# Altium project RT5572_2.4TX.PrjPcb
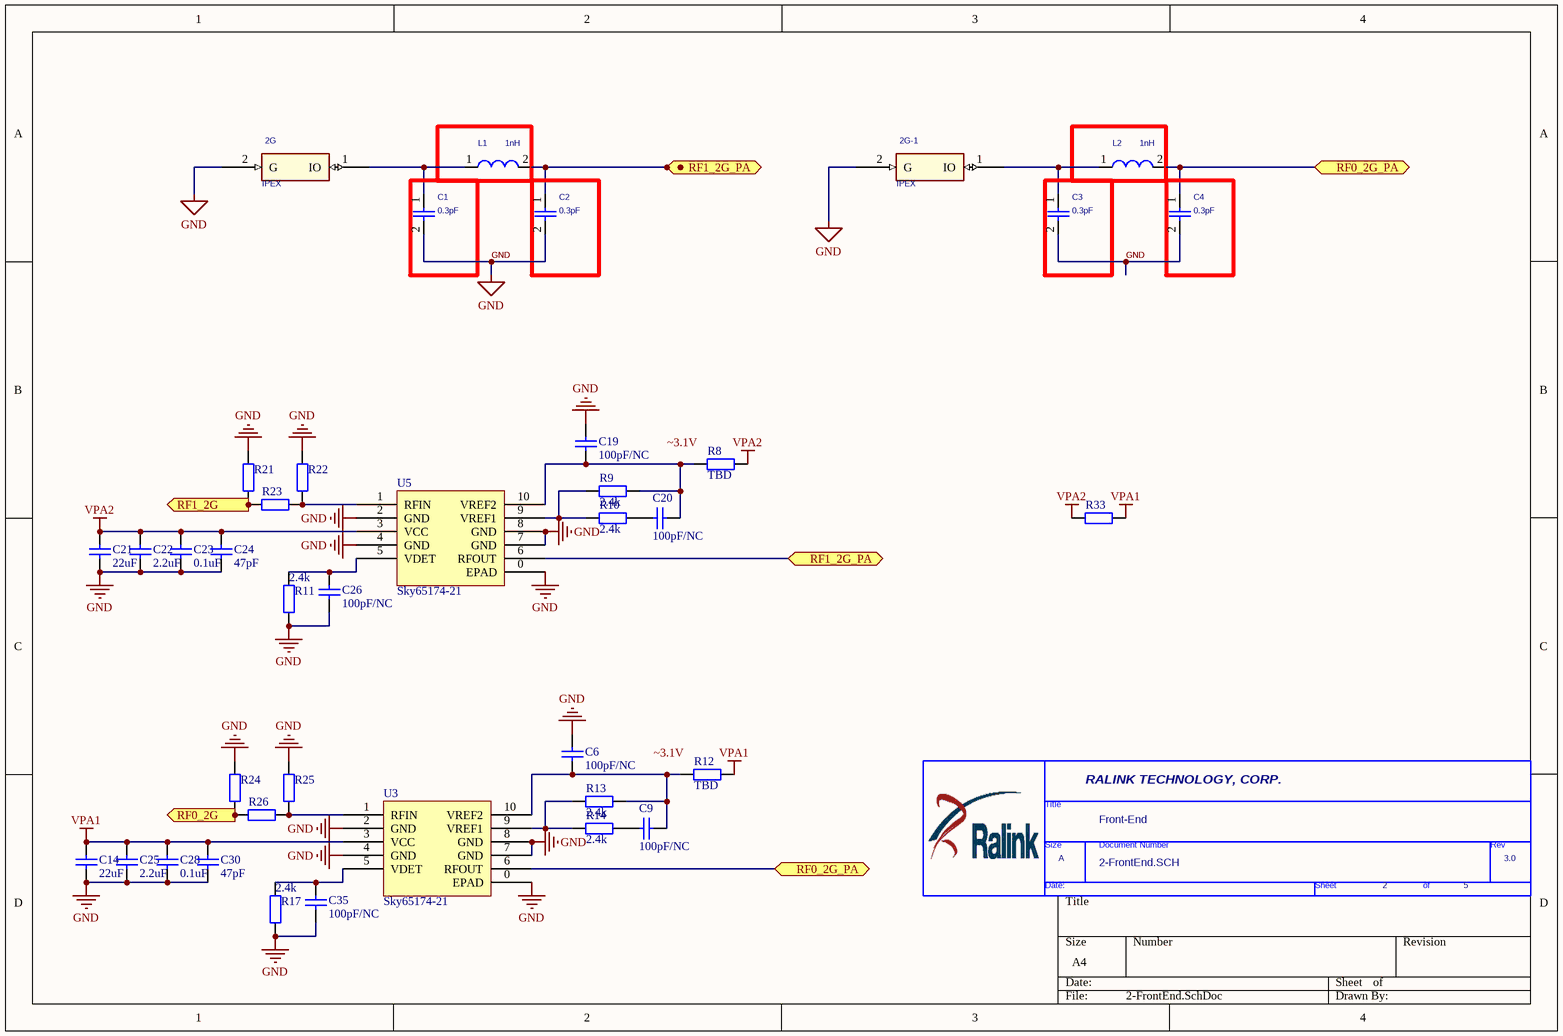
[diagram p0: 2-FrontEnd.SchDoc]
4 sheets, 123 parts. Net scope: flat (ports and power ports of the same name join across sheets).
Board file: RT5572.PcbDoc
Sheets:
  2-FrontEnd.SchDoc
  3-RT5572-WLAN.SchDoc
  4-USB-A.SchDoc
  5-BLOCK-2X2-DUAL.SchDoc

## Sheet 2-FrontEnd.SchDoc
size A4

### Parts
(Parts that share a designator on the sheet are numbered #1, #2 ... from top to bottom, then left to right.)
2G  IPEX  [IPEX]
2G-1  IPEX  [IPEX]
*#1  Page Count: 5  Page Number: 2  Page Size: A  OrgName: RALINK TECHNOLOGY, CORP.  Title: Front-End  RevCode: 3.0  Doc: 2-FrontEnd.SCH  (hidden comment: TitleBlock1-RA-new)  (graphical)
C1  0.3pF  [0402]
C2  0.3pF  [0402]
C3  0.3pF  [0402]
C4  0.3pF  [0402]
C6  value 100pF/NC  [0402]  (hidden comment: Cap)
C9  value 100pF/NC  [0402]  (hidden comment: Cap)
C14  value 22uF  [0805]  (hidden comment: Cap)
C19  value 100pF/NC  [0402]  (hidden comment: Cap)
C20  value 100pF/NC  [0402]  (hidden comment: Cap)
C21  value 22uF  [0805]  (hidden comment: Cap)
C22  value 2.2uF  [0603]  (hidden comment: Cap)
C23  value 0.1uF  [0402]  (hidden comment: Cap)
C24  value 47pF  [0402]  (hidden comment: Cap)
C25  value 2.2uF  [0603]  (hidden comment: Cap)
C26  value 100pF/NC  [0402]  (hidden comment: Cap)
C28  value 0.1uF  [0402]  (hidden comment: Cap)
C30  value 47pF  [0402]  (hidden comment: Cap)
C35  value 100pF/NC  [0402]  (hidden comment: Cap)
L1  1nH  [0402]
L2  1nH  [0402]
R8  value TBD  [0402]  (hidden comment: Res2)
R9  value 2.4k  [0402]  (hidden comment: Res2)
R10  value 2.4k  [0402]  (hidden comment: Res2)
R11  value 2.4k  [0402]  (hidden comment: Res2)
R12  value TBD  [0402]  (hidden comment: Res2)
R13  value 2.4k  [0402]  (hidden comment: Res2)
R14  value 2.4k  [0402]  (hidden comment: Res2)
R17  value 2.4k  [0402]  (hidden comment: Res2)
R21  TBD  [0402]  (value not drawn)
R22  TBD  [0402]  (value not drawn)
R23  TBD  [0402]  (value not drawn)
R24  TBD  [0402]  (value not drawn)
R25  TBD  [0402]  (value not drawn)
R26  TBD  [0402]  (value not drawn)
R33  NC/0R  [0402]  (value not drawn)
U3  Sky65174-21  [SKY65174-21]
U5  Sky65174-21  [SKY65174-21]

### Ports
RF0_2G (in), RF0_2G_PA, RF1_2G (in), RF1_2G_PA

### Nets
GND: 2G.2(G) 2G-1.2(G) C1.2 C2.2 C3.2 C4.2 C6.1 C14.2 C19.1 C21.2 C22.2 C23.2 C24.2 C25.2 C26.2 C28.2 C30.2 C35.2 R11.1 R17.1 R21.2 R22.1 R24.1 R25.1 U3.0(EPAD) U3.2(GND) U3.4(GND) U3.7(GND) U3.8(GND) U5.0(EPAD) U5.2(GND) U5.4(GND) U5.7(GND) U5.8(GND)
VPA1: C14.1 C25.1 C28.1 C30.1 R12.1 R33.2 U3.3(VCC)
VPA2: C21.1 C22.1 C23.1 C24.1 R8.1 R33.1 U5.3(VCC)
RF0_2G: R24.2 R26.1 ; port RF0_2G
RF1_2G: R21.1 R23.1 ; port RF1_2G
Net2G-1_1: 2G-1.1(IO) C3.1 L2.1
Net2G_1: 2G.1(IO) C1.1 L1.1
NetC2_1: C2.1 L1.2 U5.6(RFOUT) ; port RF1_2G_PA
NetC4_1: C4.1 L2.2 U3.6(RFOUT) ; port RF0_2G_PA
NetC6_2: C6.2 C9.2 R12.2 R13.1 U3.10(VREF2)
NetC9_1: C9.1 R14.1
NetC19_2: C19.2 C20.2 R8.2 R9.1 U5.10(VREF2)
NetC20_1: C20.1 R10.1
NetC26_1: C26.1 R11.2 U5.5(VDET)
NetC35_1: C35.1 R17.2 U3.5(VDET)
NetR9_2: R9.2 R10.2 U5.9(VREF1)
NetR13_2: R13.2 R14.2 U3.9(VREF1)
NetR22_2: R22.2 R23.2 U5.1(RFIN)
NetR25_2: R25.2 R26.2 U3.1(RFIN)

### Notes on the sheet
- Labels drawn without touching a wire or pin: ~3.1V
- (in symbol TitleBlock1-RA-new) Title; Size; Document Number; Rev; Date:; Sheet; of

### Library data of the parts
2G 2G-1 = ANT-RA-USB-1
C1-C4 = CAP/0402
C6 C9 C14 C19-C26 C28 C30 C35 = Cap: Capacitor; Published: 8-Jun-2000; LatestRevisionDate: 17-Jul-2002; LatestRevisionNote: Re-released for DXP Platform.; PackageReference: RAD-0.3; Publisher: Altium Limited; PackageDescription: Radial Cap, Thru-Hole; 2 Leads; 0.3 in Pin Spacing
L1 L2 = L/0402
R8-R14 R17 R21-R26 R33 = Res2: Resistor; Published: 8-Jun-2000; LatestRevisionDate: 17-Jul-2002; LatestRevisionNote: Re-released for DXP Platform.; PackageReference: AXIAL-0.4; Publisher: Altium Limited; PackageDescription: Axial Device, Thru-Hole; 2 Leads; 0.4 in Pin Spacing
*#1 = TitleBlock1-RA-new: Page Create Date: March  8, 1995

## Sheet 3-RT5572-WLAN.SchDoc
size A2
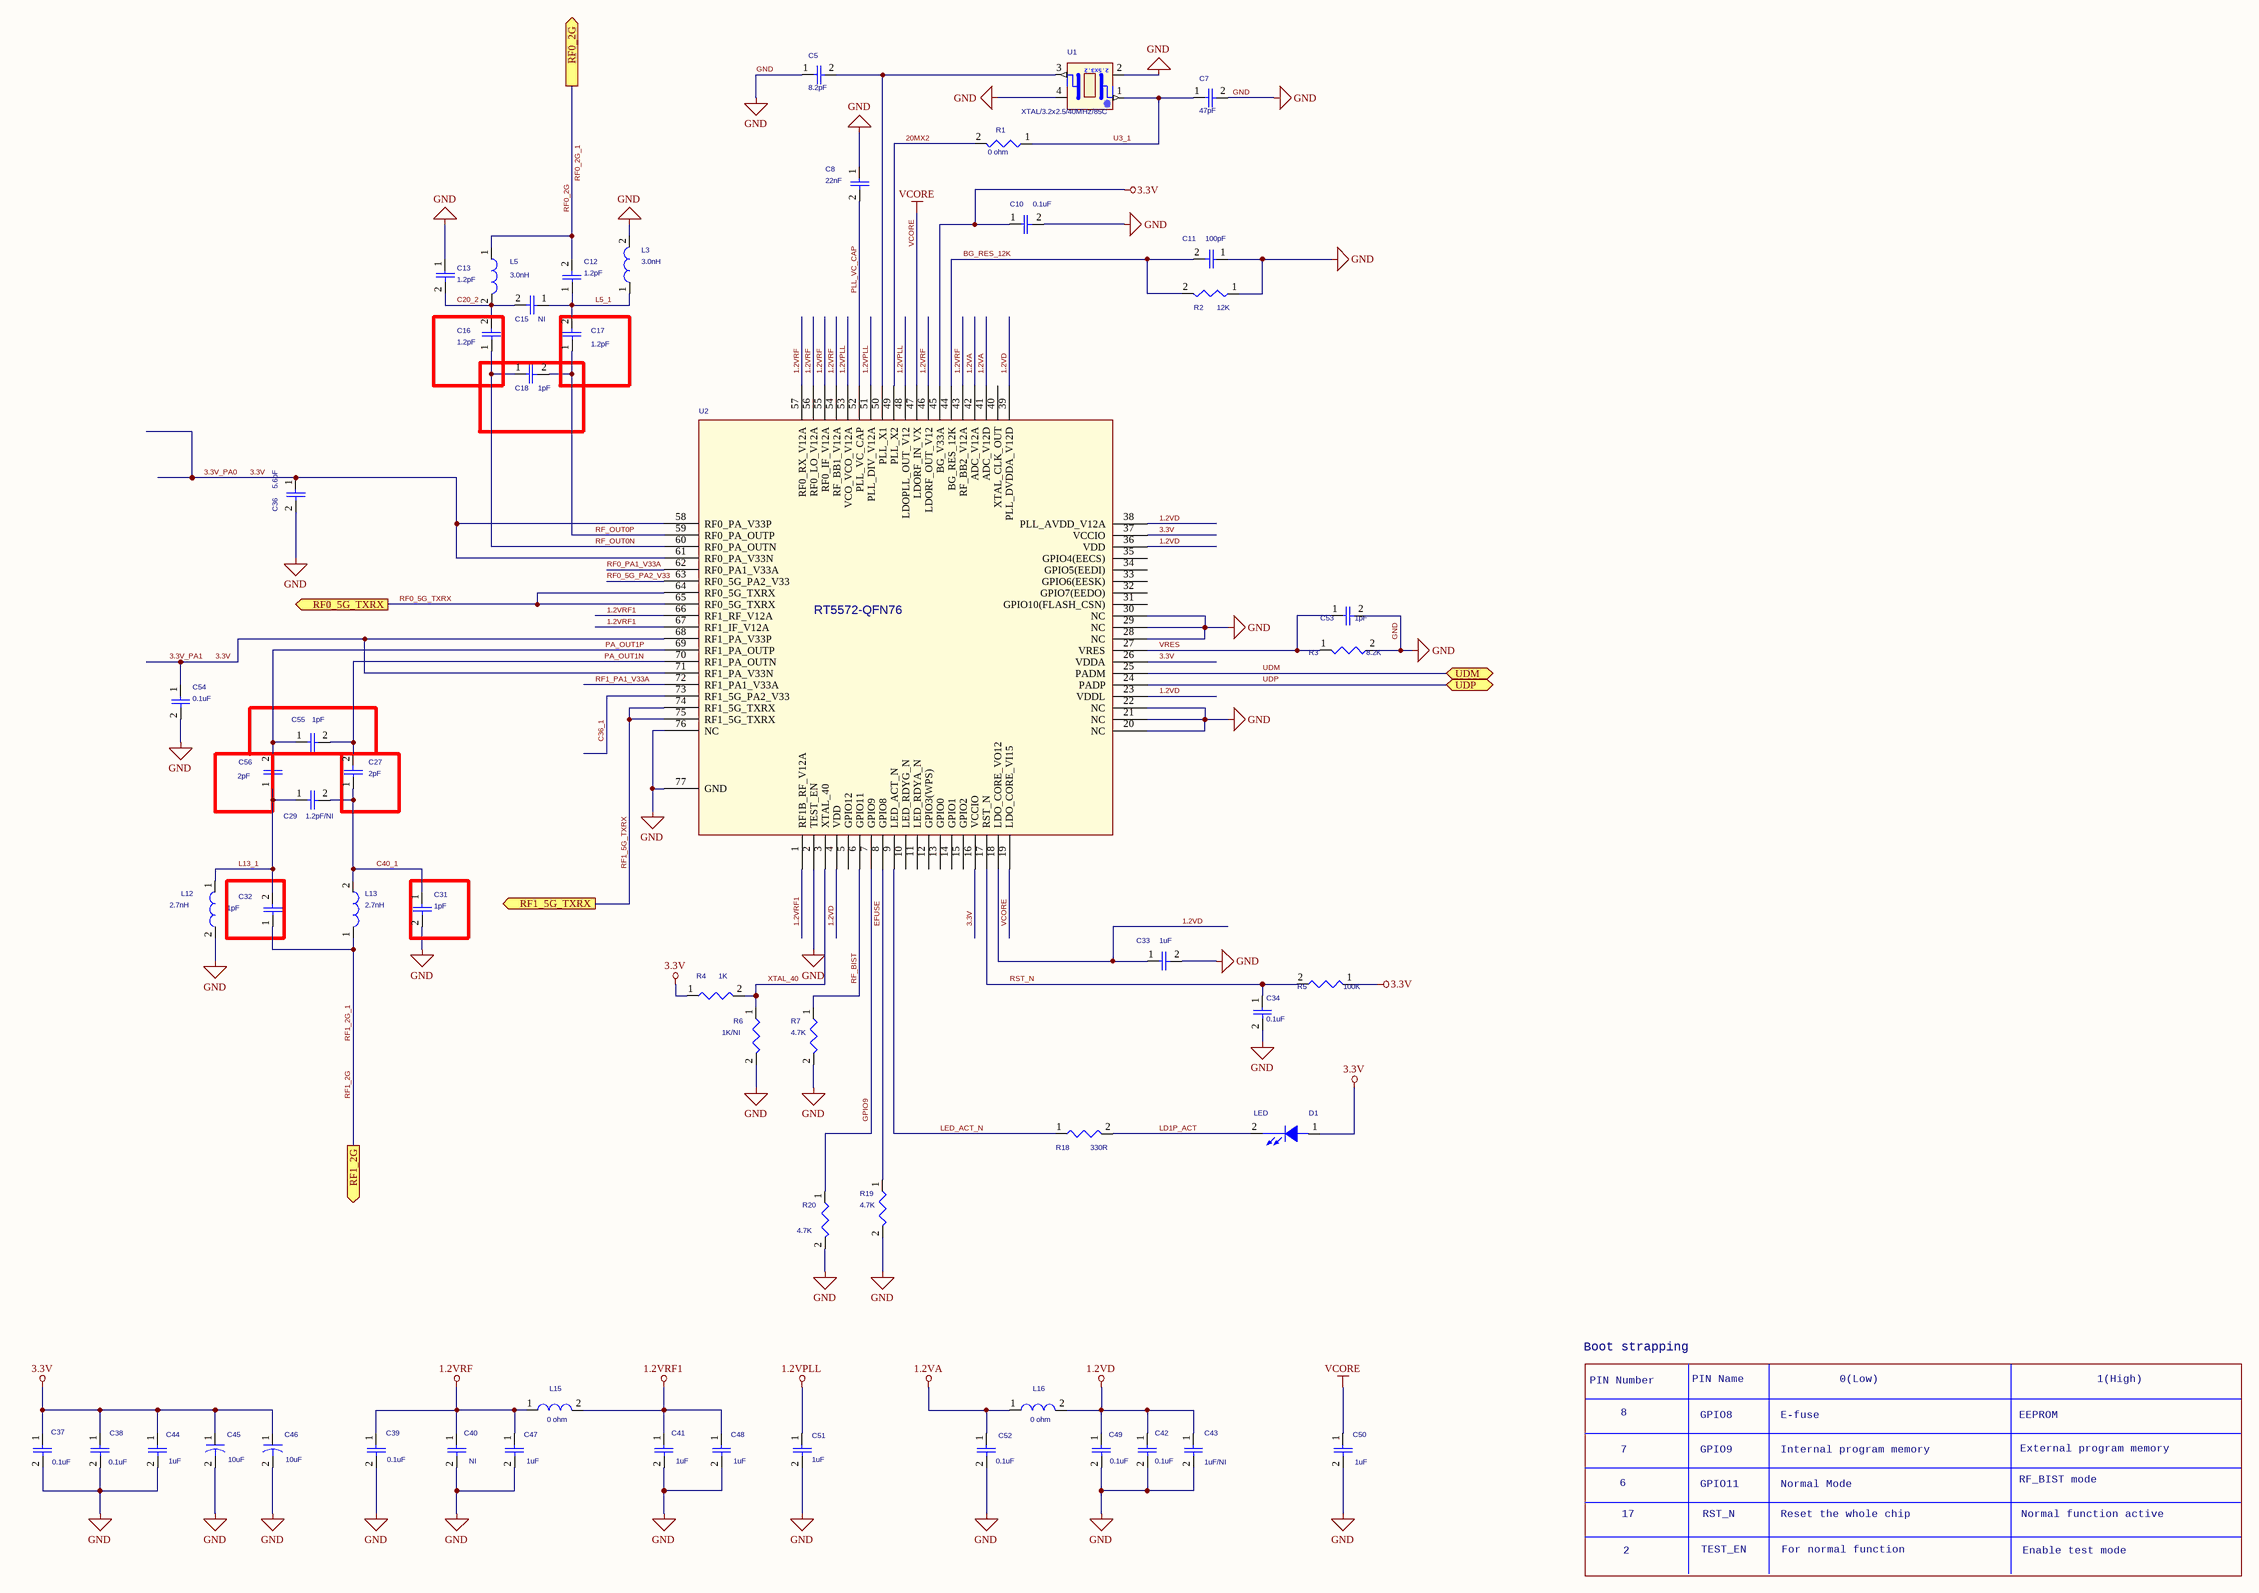
[diagram p1: 3-RT5572-WLAN.SchDoc]

### Parts
C5  8.2pF  [0402]
C7  47pF  [0402]
C8  22nF  [0402]
C10  0.1uF  [0402]
C11  100pF  [0402]
C12  1.2pF  [0402]
C13  1.2pF  [0402]
C15  NI  [0402]
C16  1.2pF  [0402]
C17  1.2pF  [0402]
C18  1pF  [0402]
C27  2pF  [0402]
C29  1.2pF/NI  [0402]
C31  1pF  [0402]
C32  1pF  [0402]
C33  1uF  [0402]
C34  0.1uF  [0402]
C36  5.6pF  [0402]
C37  0.1uF  [0402]
C38  0.1uF  [0402]
C39  0.1uF  [0402]
C40  NI  [0402]
C41  1uF  [0402]
C42  0.1uF  [0402]
C43  1uF/NI  [0402]
C44  1uF  [0402]
C45  10uF  [0805]
C46  10uF  [0805]
C47  1uF  [0402]
C48  1uF  [0402]
C49  0.1uF  [0402]
C50  1uF  [0402]
C51  1uF  [0402]
C52  0.1uF  [0402]
C53  1pF  [0402]
C54  0.1uF  [0402]
C55  1pF  [0402]
C56  2pF  [0402]
D1  LED  [0603]
L3  3.0nH  [0402]
L5  3.0nH  [0402]
L12  2.7nH  [0402]
L13  2.7nH  [0402]
L15  0 ohm  [0402]
L16  0 ohm  [0402]
R1  0 ohm  [0402]
R2  12K  [0402]
R3  8.2K  [0402]
R4  1K  [0402]
R5  100K  [0402]
R6  1K/NI  [0402]
R7  4.7K  [0402]
R18  330R  [0402]
R19  4.7K  [0402]
R20  4.7K  [0402]
U1  XTAL/3.2x2.5/40MHz/85C  [XTAL-SMD/3.2X2.5]
U2  RT5572-QFN76  [QFN40P-900X900X90-77N]

### Ports
RF0_2G (out), RF0_5G_TXRX (out), RF1_2G (out), RF1_5G_TXRX (out), UDM (bidir), UDP (bidir)

### Nets
1.2VA: C52.1 L16.1 U2.41(ADC_V12D) U2.42(ADC_V12A)
1.2VD: C33.1 C42.1 C43.1 C49.1 L16.2 U2.4(VDD) U2.18(LDO_CORE_VO12) U2.23(VDDL) U2.36(VDD) U2.38(PLL_AVDD_V12A) U2.39(PLL_DVDDA_V12D)
1.2VPLL: C51.1 U2.48(LDOPLL_OUT_V12) U2.51(PLL_DIV_V12A) U2.53(VCO_VCO_V12A)
1.2VRF: C39.1 C40.1 C47.1 L15.1 U2.43(RF_BB2_V12A) U2.46(LDORF_OUT_V12) U2.54(RF_BB1_V12A) U2.55(RF0_IF_V12A) U2.56(RF0_LO_V12A) U2.57(RF0_RX_V12A)
1.2VRF1: C41.1 C48.1 L15.2 U2.1(RF1B_RF_V12A) U2.66(RF1_RF_V12A) U2.67(RF1_IF_V12A)
3.3V: C10.1 C36.1 C37.1 C38.1 C44.1 C45.1 C46.1 C54.1 D1.1(ANODE) R4.1 R5.1 U2.16(VCCIO) U2.26(VDDA) U2.37(VCCIO) U2.45(BG_V33A) U2.58(RF0_PA_V33P) U2.61(RF0_PA_V33N) U2.68(RF1_PA_V33P) U2.71(RF1_PA_V33N)  [also labelled 3.3V_PA0, 3.3V_PA1]
GND: C5.1 C7.2 C8.1 C10.2 C11.1 C13.1 C31.2 C33.2 C34.2 C36.2 C37.2 C38.2 C39.2 C40.2 C41.2 C42.2 C43.2 C44.2 C45.2 C46.2 C47.2 C48.2 C49.2 C50.2 C51.2 C52.2 C53.2 C54.2 L3.2 L12.2 R2.1 R3.2 R6.2 R7.2 R19.2 R20.2 U1.2(NC) U1.4(NC) U2.2(TEST_EN) U2.20(NC) U2.21(NC) U2.22(NC) U2.28(NC) U2.29(NC) U2.30(NC) U2.76(NC) U2.77(GND)
VCORE: C50.1 U2.19(LDO_CORE_VI15) U2.47(LDORF_IN_VX)
20MX2: R1.2 U2.49(PLL_X2)
BG_RES_12K: C11.2 R2.2 U2.44(BG_RES_12K)
C20_2: C13.2 C15.2 C16.2 L5.2
C36_1: U2.73(RF1_5G_PA2_V33)
C40_1: C27.1 C29.2 C31.1 L13.2
EFUSE: R19.1 U2.8(GPIO8)
GPIO9: R20.1 U2.7(GPIO9)
L5_1: C12.1 C15.1 C17.2 L3.1
L13_1: C29.1 C32.2 C56.1 L12.1
LD1P_ACT: D1.2(CATHODE) R18.2
LED_ACT_N: R18.1 U2.9(LED_ACT_N)
PA_OUT1N: C27.2 C55.2 U2.70(RF1_PA_OUTN)
PA_OUT1P: C55.1 C56.2 U2.69(RF1_PA_OUTP)
PLL_VC_CAP: C8.2 U2.52(PLL_VC_CAP)
RF0_2G: C12.2 L5.1 ; port RF0_2G  [also labelled RF0_2G_1]
RF0_5G_PA2_V33: U2.63(RF0_5G_PA2_V33)
RF0_5G_TXRX: U2.64(RF0_5G_TXRX) U2.65(RF0_5G_TXRX) ; port RF0_5G_TXRX
RF0_PA1_V33A: U2.62(RF0_PA1_V33A)
RF1_2G: C32.1 L13.1 ; port RF1_2G  [also labelled RF1_2G_1]
RF1_5G_TXRX: U2.74(RF1_5G_TXRX) U2.75(RF1_5G_TXRX) ; port RF1_5G_TXRX
RF1_PA1_V33A: U2.72(RF1_PA1_V33A)
RF_BIST: R7.1 U2.6(GPIO11)
RF_OUT0N: C16.1 C18.1 U2.60(RF0_PA_OUTN)
RF_OUT0P: C17.1 C18.2 U2.59(RF0_PA_OUTP)
RST_N: C34.1 R5.2 U2.17(RST_N)
U3_1: C7.1 R1.1 U1.1(X1)
UDM: U2.25(PADM) ; port UDM
UDP: U2.24(PADP) ; port UDP
VRES: C53.1 R3.1 U2.27(VRES)
XTAL_40: R4.2 R6.1 U2.3(XTAL_40)
NetC5_2: C5.2 U1.3(X2) U2.50(PLL_X1)

Not connected (* = marked no-connect by the designer): U2 5(GPIO12) 10(LED_RDYG_N) 11(LED_RDYA_N) 12(GPIO3(WPS)) 13(GPIO0) 14(GPIO1) 15(GPIO2) 31(GPIO10(FLASH_CSN)) 32(GPIO7(EEDO)) 33(GPIO6(EESK)) 34(GPIO5(EEDI)) 35(GPIO4(EECS)) 40(XTAL_CLK_OUT)

### Notes on the sheet
- Boot strapping
- PIN Number
- PIN Name
- 0(Low)
- 1(High)
- 8
- 7
- GPIO8
- GPIO9
- E-fuse
- Internal program memory
- EEPROM
- External program memory
- 6
- GPIO11
- Normal Mode
- RF_BIST mode
- 17
- 2
- TEST_EN
- RST_N
- Reset the whole chip
- For normal function
- Normal function active
- Enable test mode
- (in symbol XTAL_2.5) 2.5x3.2

### Library data of the parts
C5 C7 C8 C10-C13 C15-C18 C27 C29 C31-C34 C36-C44 C47-C56 = CAP/0402
  C8 C10 C11 C33 C34 C36-C44 C47-C54: 1st Part Field: 0402
C45 C46 = CAP/0603
D1 = LED/0603
L3 L5 L13 L15 L16 = L/0402
L12 = L/0402_0
R1 R2 R5 = RES/0402_1_Dup1
R3 = RES/0402_2
R4 R6 R7 R19 R20 = RES/0402_1_Dup2
R18 = RES/0402_1
U1 = XTAL_2.5
U2 = RT5572_5

## Sheet 4-USB-A.SchDoc
size A4
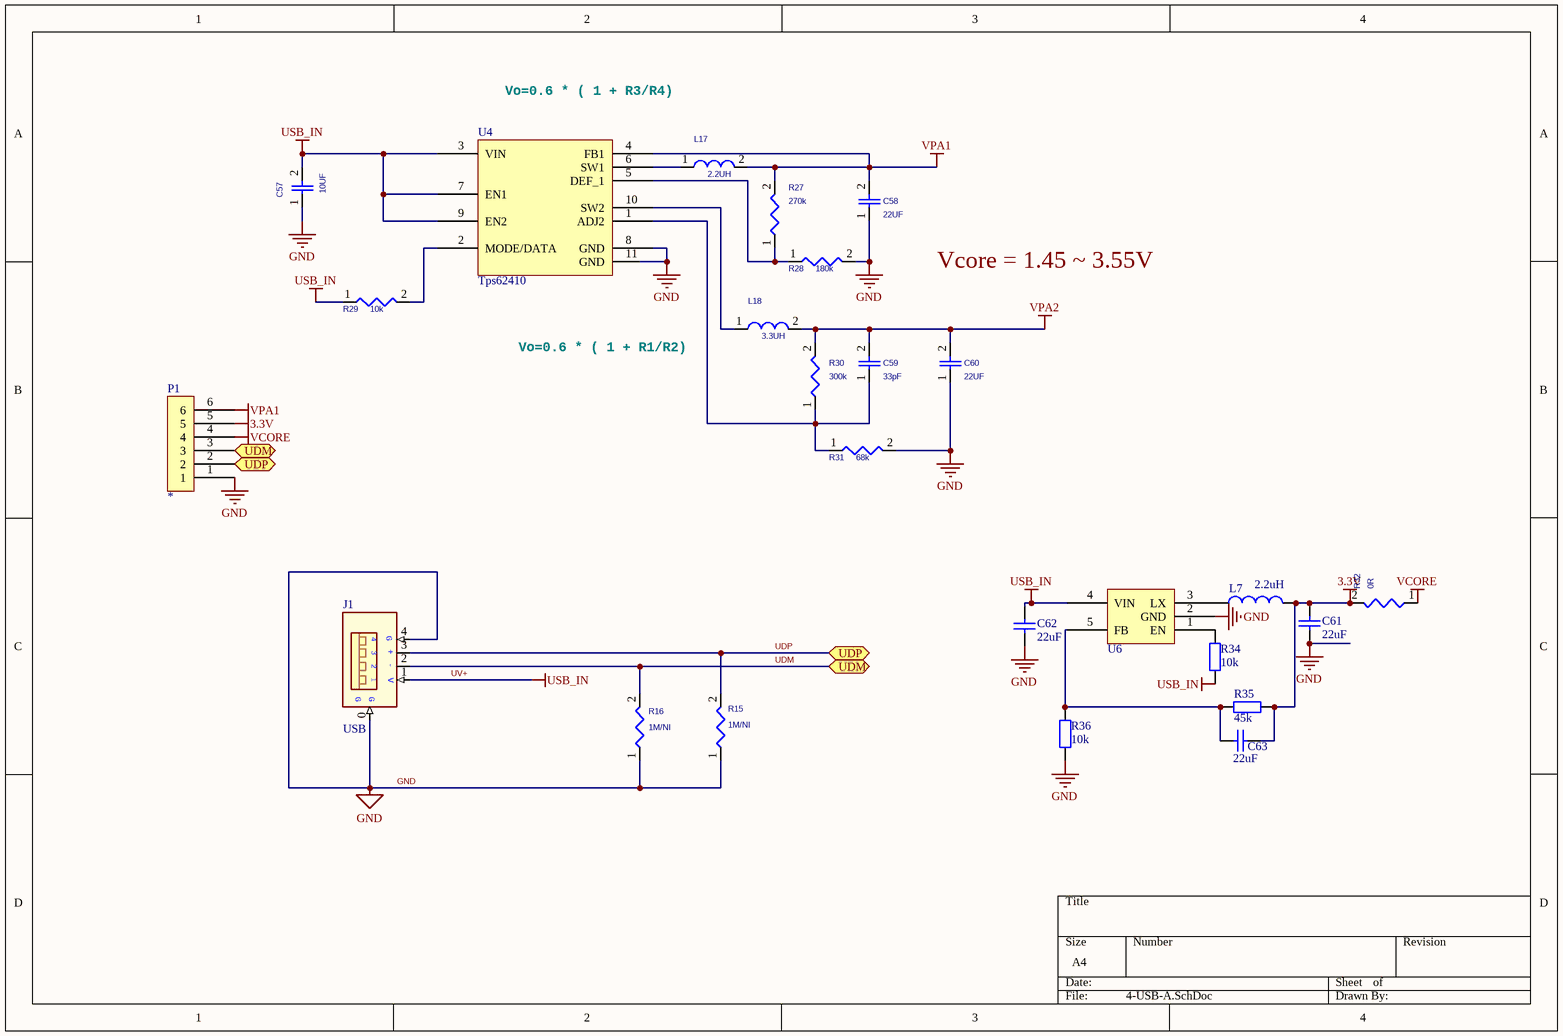
[diagram p2: 4-USB-A.SchDoc]

### Parts
C57  10UF  [0805]
C58  22UF  [0805]
C59  33pF  [0402]
C60  22UF  [0805]
C61  value 22uF  [0805]  (hidden comment: Cap)
C62  value 22uF  [0805]  (hidden comment: Cap)
C63  value 22uF  [0402]  (hidden comment: Cap)
J1  USB  [USB-A-MALE]
L7  2.2uH  [0805]
L17  2.2UH  [L3015]
L18  3.3UH  [L3015]
P1  *  [6PSocket]
R15  1M/NI  [0402]
R16  1M/NI  [0402]
R27  270k  [0402]
R28  180k  [0402]
R29  10k  [0402]
R30  300k  [0402]
R31  68k  [0402]
R32  0R  [0402]
R34  10k  [0402]
R35  45k  [0402]
R36  10k  [0402]
U4  Tps62410  [DFN-10P-3X3]
U6  RT8059  [SOT23-5]  (value not drawn)

### Ports
UDM (bidir), UDP (bidir)

### Nets
3.3V: C61.2 C63.1 L7.2 P1.5 R32.2 R35.2
GND: C57.1 C58.1 C60.1 C61.1 C62.1 J1.0(G) J1.4(G) P1.1 R15.1 R16.1 R28.2 R31.2 R36.1 U4.8(GND) U4.11(GND) U6.2(GND)
UV+: C57.2 C62.2 J1.1(V+) R29.1 R34.2 U4.3(VIN) U4.7(EN1) U4.9(EN2) U6.4(VIN)  [also labelled USB_IN]
VCORE: P1.4 R32.1
VPA1: C58.2 L17.2 P1.6 R27.2 U4.4(FB1)
VPA2: C59.2 C60.2 L18.2 R30.2
UDM: J1.2(D-) P1.3 R16.2 ; port UDM
UDP: J1.3(D+) P1.2 R15.2 ; port UDP
NetC59_1: C59.1 R30.1 R31.1 U4.1(ADJ2)
NetC63_2: C63.2 R35.1 R36.2 U6.5(FB)
NetL7_1: L7.1 U6.3(LX)
NetL17_1: L17.1 U4.6(SW1)
NetL18_1: L18.1 U4.10(SW2)
NetR27_1: R27.1 R28.1 U4.5(DEF_1)
NetR29_2: R29.2 U4.2(MODE/DATA)
NetR34_1: R34.1 U6.1(EN)

### Notes on the sheet
- Vo=0.6 * ( 1 + R3/R4)
- Vcore = 1.45 ~ 3.55V
- Vo=0.6 * ( 1 + R1/R2)
- (in symbol USB) +; -; V

### Library data of the parts
C57 C58 C60 = CAP/0402: 1st Part Field: 0402
C59 = CAP/0402: 1st Part Field: 0402
C61-C63 = Cap: Capacitor; Published: 8-Jun-2000; LatestRevisionDate: 17-Jul-2002; LatestRevisionNote: Re-released for DXP Platform.; PackageReference: RAD-0.3; Publisher: Altium Limited; PackageDescription: Radial Cap, Thru-Hole; 2 Leads; 0.3 in Pin Spacing
L7 = Inductor: Code_IEC: 1005; Published: 8-Jun-2000; LatestRevisionDate: 29-May-2009; LatestRevisionNote: IPC-7351 Footprint Added.; PackageReference: 0402-A; Publisher: Altium Limited; PackageDescription: Chip Inductor; Code_JEITA: 0402
L17 L18 = L/2.5*2.0
P1 = 6PSocket
R15 R16 = RES/0402_2
R27-R32 = RES/0402_3
R34-R36 = Res2: Resistor; Published: 8-Jun-2000; LatestRevisionDate: 17-Jul-2002; LatestRevisionNote: Re-released for DXP Platform.; PackageReference: AXIAL-0.4; Publisher: Altium Limited; PackageDescription: Axial Device, Thru-Hole; 2 Leads; 0.4 in Pin Spacing

## Sheet 5-BLOCK-2X2-DUAL.SchDoc
size A2
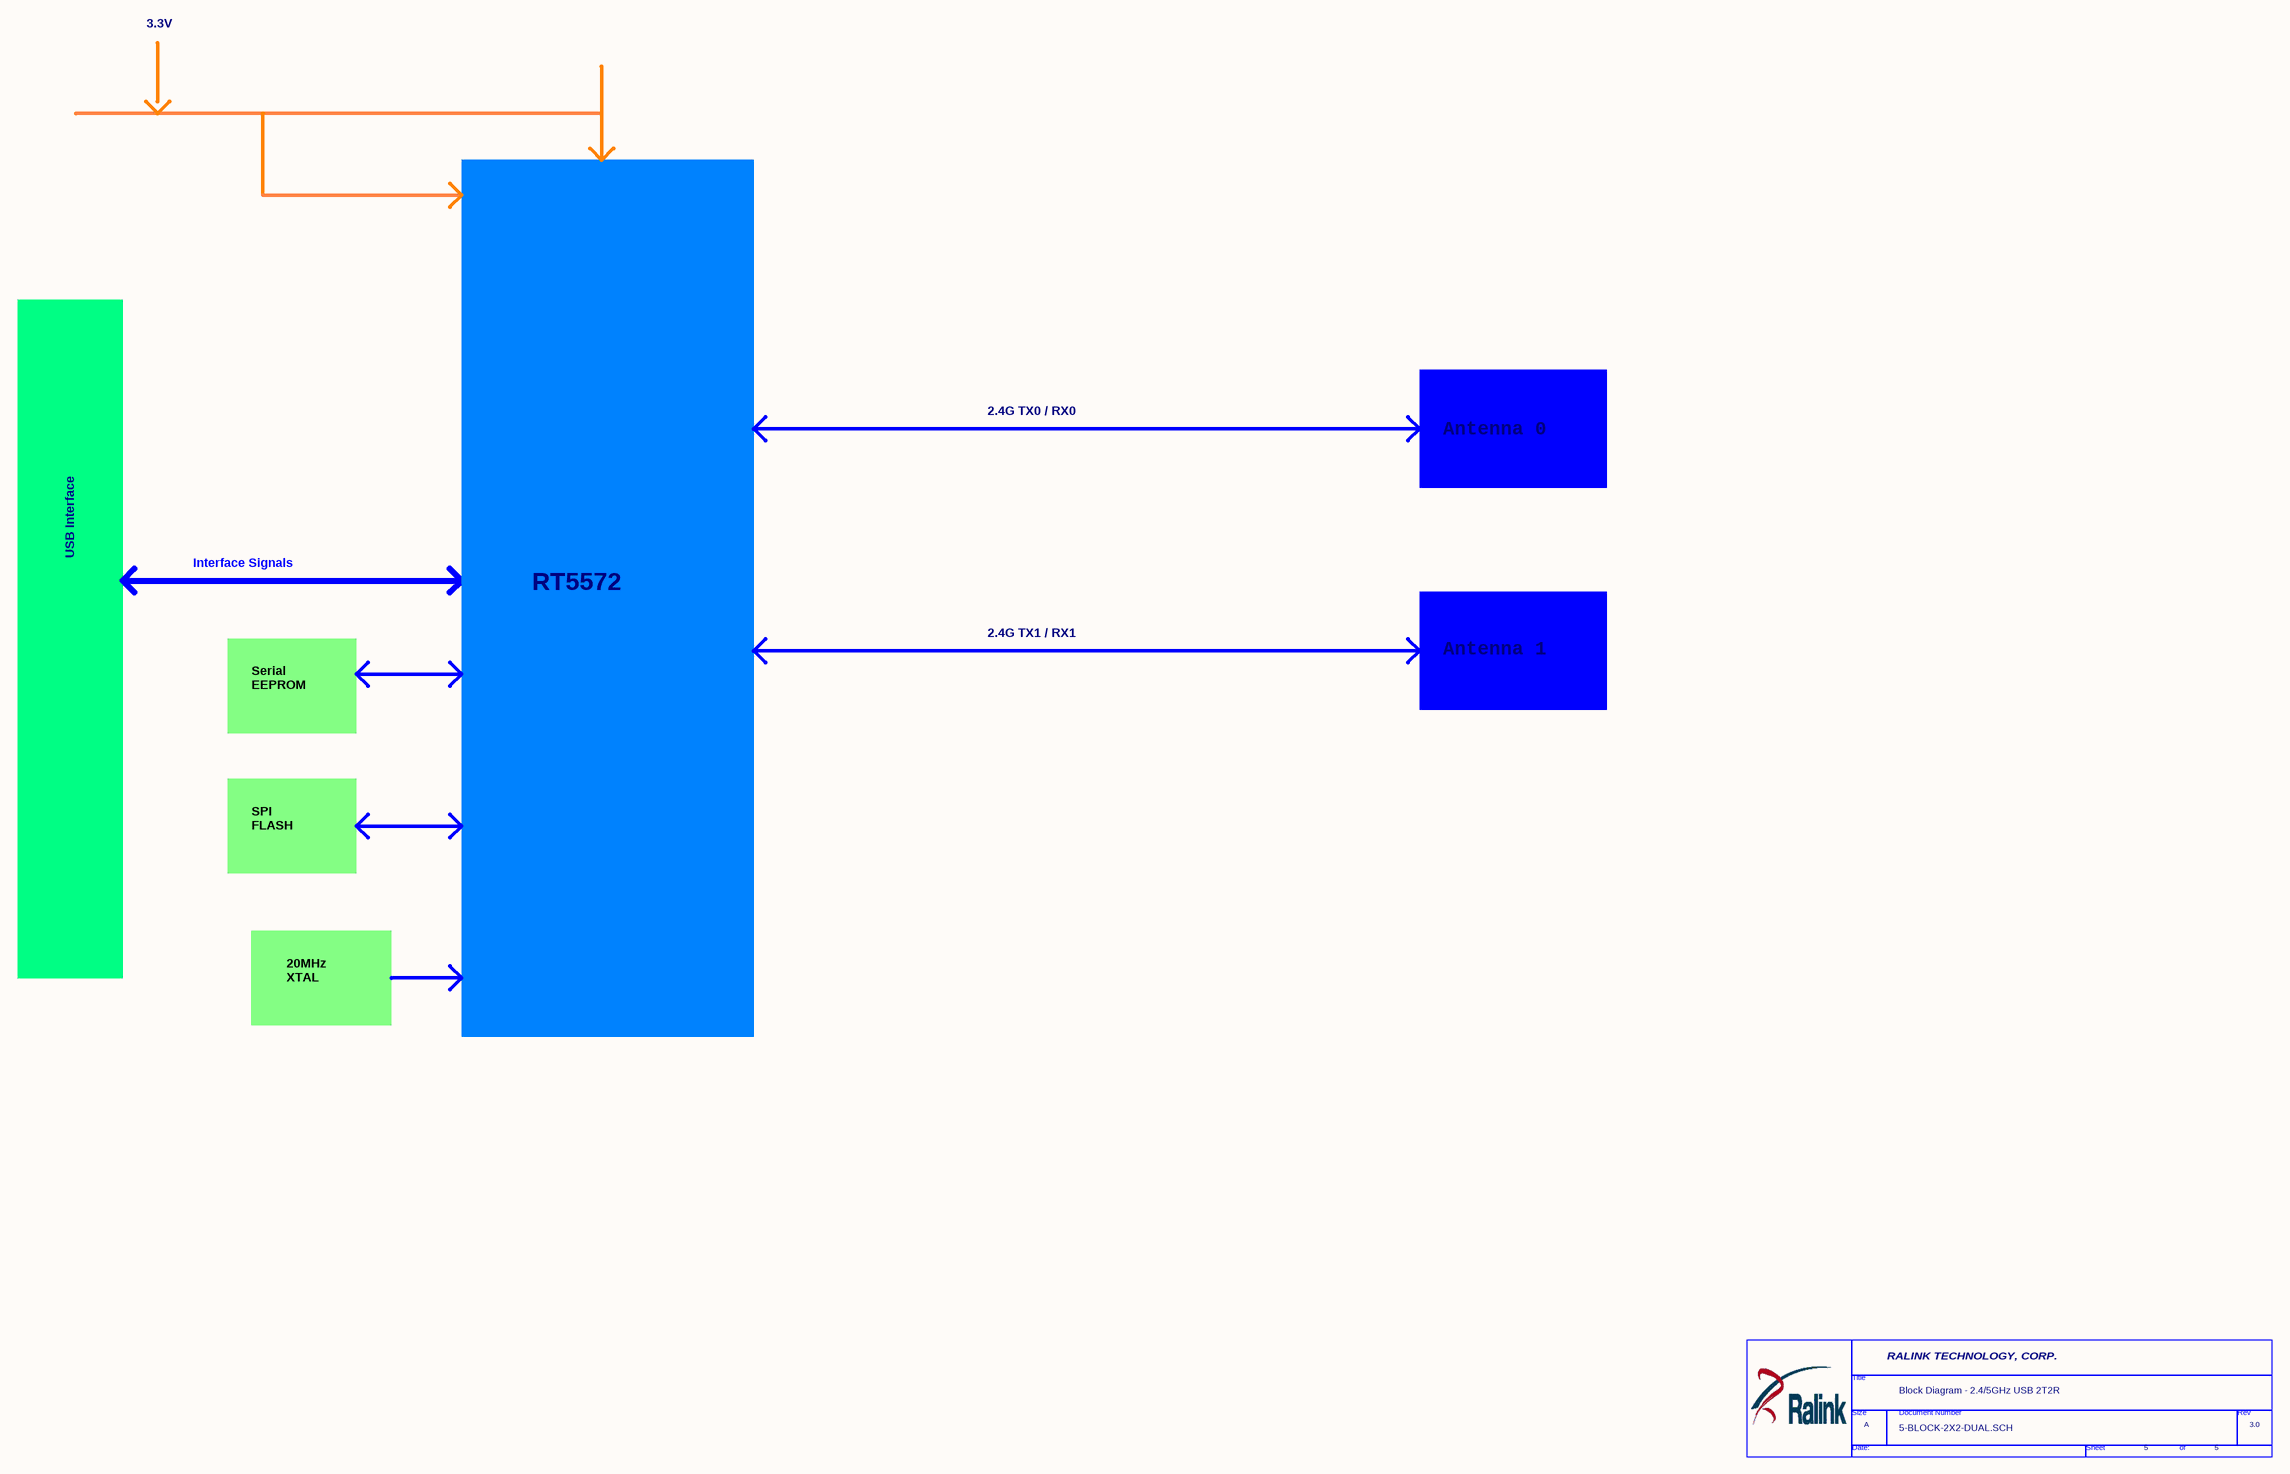
[diagram p3: 5-BLOCK-2X2-DUAL.SchDoc]

### Parts
(Parts that share a designator on the sheet are numbered #1, #2 ... from top to bottom, then left to right.)
*#2  Page Count: 5  Page Size: A  OrgName: RALINK TECHNOLOGY, CORP.  Title: Block Diagram - 2.4/5GHz USB 2T2R  RevCode: 3.0  Doc: 5-BLOCK-2X2-DUAL.SCH  (hidden comment: TitleBlock1-RA-new)  (graphical)

### Notes on the sheet
- 3.3V
- 2.4G TX0 / RX0
- Antenna 0
- USB Interface
- Interface Signals
- RT5572
- 2.4G TX1 / RX1
- Antenna 1
- Serial
  EEPROM
- SPI
  FLASH
- 20MHz
  XTAL
- (in symbol TitleBlock1-RA-new) Title; Size; Document Number; Rev; Date:; Sheet; of

### Library data of the parts
*#2 = TitleBlock1-RA-new: Page Number: 5; Page Create Date: March  8, 1995

## Nets that join several sheets
3.3V: 3-RT5572-WLAN (19 pins), 4-USB-A (6 pins)
GND: 2-FrontEnd (34 pins), 3-RT5572-WLAN (47 pins), 4-USB-A (16 pins)
VCORE: 3-RT5572-WLAN (C50.1 U2.19 U2.47), 4-USB-A (P1.4 R32.1)
VPA1: 2-FrontEnd (7 pins), 4-USB-A (5 pins)
VPA2: 2-FrontEnd (7 pins), 4-USB-A (C59.2 C60.2 L18.2 R30.2)
RF0_2G: 2-FrontEnd (R24.2 R26.1), 3-RT5572-WLAN (C12.2 L5.1)
RF1_2G: 2-FrontEnd (R21.1 R23.1), 3-RT5572-WLAN (C32.1 L13.1)
UDM: 3-RT5572-WLAN (U2.25), 4-USB-A (J1.2 P1.3 R16.2)
UDP: 3-RT5572-WLAN (U2.24), 4-USB-A (J1.3 P1.2 R15.2)